# Altium schematic sheet POWER.SchDoc
size A4
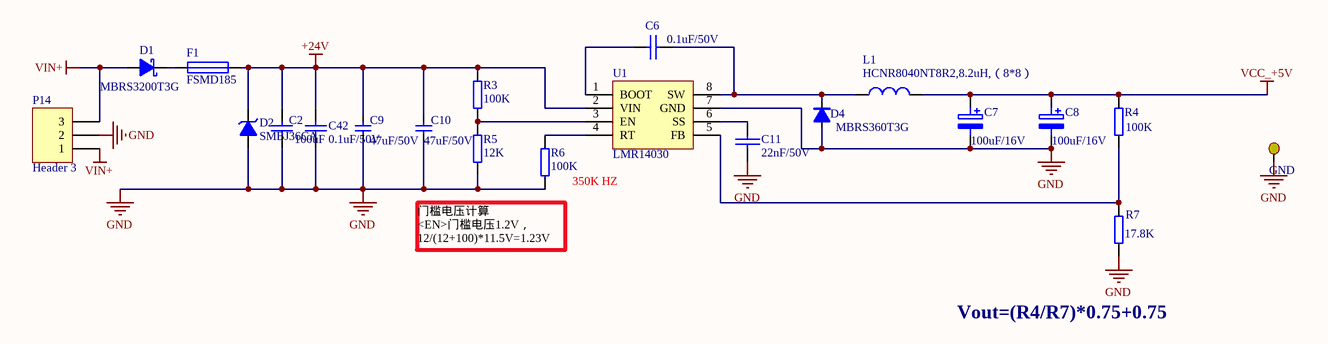
[diagram p0: POWER.SchDoc]

## Parts
C2  100uF  [CAP 8X12 -2]
C6  0.1uF/50V  [0603C]
C7  100uF/16V  [CAPTANC]
C8  100uF/16V  [CAPTANC]
C9  47uF/50V  [1812C]
C10  47uF/50V  [1812C]
C11  22nF/50V  [0603C]
C42  0.1uF/50V  [1206C]
D1  MBRS3200T3G  [DO-214AA]
D2  SMBJ36CA  [DO-214AA]
D4  MBRS360T3G  [DO214AB]
F1  FSMD185  [1812R - duplicate1]
GND  Test Point  [TestPoint-2]  (value not drawn)
L1  HCNR8040NT8R2,8.2uH,（8*8）  [电感]
P14  Header 3  [HT396  3P]
R3  100K  [0603R]
R4  100K  [0603R]
R5  12K  [0603R]
R6  100K  [0603R]
R7  17.8K  [0603R]
U1  LMR14030  [LMR14030]

## Nets
+24V: C2.2 C9.1 C10.1 C42.2 D2.2(K) F1.2 R3.1 U1.2(VIN)
GND: C2.1 C7.2 C8.2 C9.2 C10.2 C11.1 C42.1 D2.1(A) D4.1 GND.0 P14.2 R5.1 R6.1 R7.2 U1.7(GND)
VCC_+5V: C7.1 C8.1 L1.2 R4.1
VIN+: D1.1(A) P14.1 P14.3
NetC6_1: C6.1 D4.2 L1.1 U1.8(SW)
NetC6_2: C6.2 U1.1(BOOT)
NetC11_2: C11.2 U1.6(SS)
NetD1_2: D1.2(K) F1.1
NetR3_2: R3.2 R5.2 U1.3(EN)
NetR4_2: R4.2 R7.1 U1.5(FB)
NetR6_2: R6.2 U1.4(RT)

## Notes on the sheet
- 350K HZ
- 门槛电压计算
  <EN>门槛电压1.2V，
  12/(12+100)*11.5V=1.23V
- Vout=(R4/R7)*0.75+0.75

## Library data of the parts
C2 C42 = Cap: Capacitor; Value: 104; Published: 8-Jun-2000; LatestRevisionDate: 17-Jul-2002; LatestRevisionNote: Re-released for DXP Platform.; Publisher: Altium Limited
C6 C11 = 0603C
C7 C8 = EC: Electrolytic Capacitor; 钽?: *
C9 C10 = CAP
D1 = D Schottky: Schottky Diode; Published: 8-Jun-2000; LatestRevisionDate: 17-Jul-2002; LatestRevisionNote: Re-released for DXP Platform.; Publisher: Altium Limited; Code_JEDEC: DO-214-AA
D2 = D Zener: Zener Diode; Published: 8-Jun-2000; LatestRevisionDate: 17-Jul-2002; LatestRevisionNote: Re-released for DXP Platform.; Publisher: Altium Limited
D4 = DIODE_A
F1 = FUSE1: Fuse
GND = TestPoint
L1 = INDUCTOR: MSS1260T-103MLD  12*12 10UH 6.92A
P14 = Header 3: Header, 3-Pin; LatestRevisionDate: 17-Jul-2002; LatestRevisionNote: Re-released for DXP Platform.; Publisher: Altium Limited
R3-R7 = RES2A